# Altium schematic sheet SMUTop.SchDoc
size A; SheetNumber: 9; SheetTotal: 11
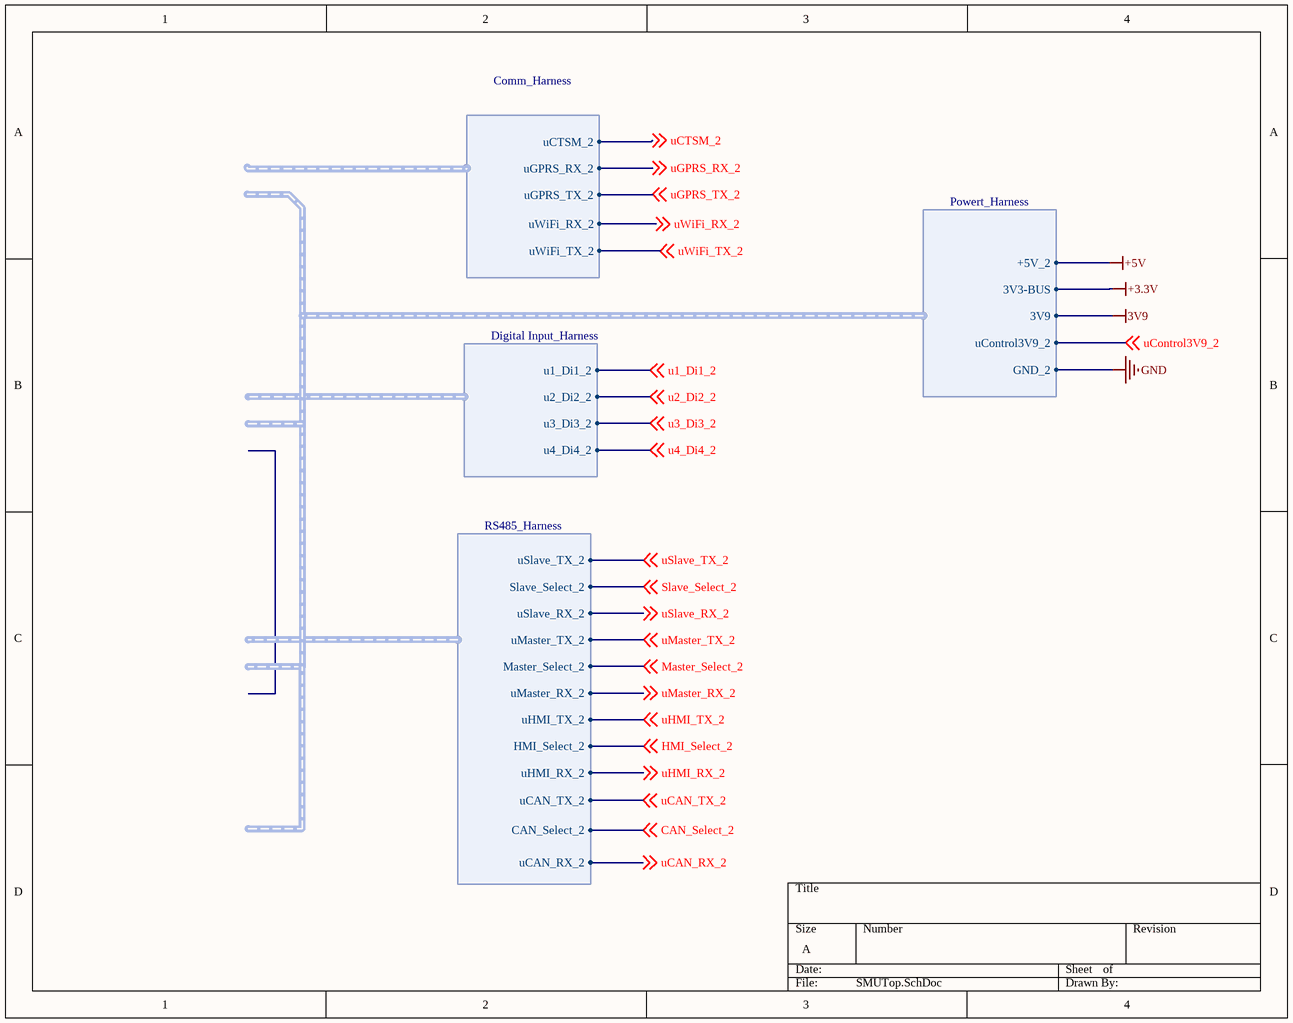
[diagram p0: SMUTop.SchDoc]

## Harnesses
Digital Input_Harness: u1_Di1_2, u2_Di2_2, u3_Di3_2, u4_Di4_2
Powert_Harness: +5V_2, 3V3-BUS, 3V9, uControl3V9_2, GND_2
RS485_Harness: uSlave_TX_2, Slave_Select_2, uSlave_RX_2, uMaster_TX_2, Master_Select_2, uMaster_RX_2, uHMI_TX_2, HMI_Select_2, uHMI_RX_2, uCAN_TX_2, CAN_Select_2, uCAN_RX_2
Comm_Harness: uCTSM_2, uGPRS_RX_2, uGPRS_TX_2, uWiFi_TX_2, uWiFi_RX_2

## Nets
3V9: harness Powert_Harness.3V9
+3.3V: harness Powert_Harness.3V3-BUS
+5V: harness Powert_Harness.+5V_2
GND: harness Powert_Harness.GND_2
CAN_Select_2: off-sheet CAN_Select_2, harness RS485_Harness.CAN_Select_2
HMI_Select_2: off-sheet HMI_Select_2, harness RS485_Harness.HMI_Select_2
Master_Select_2: off-sheet Master_Select_2, harness RS485_Harness.Master_Select_2
Slave_Select_2: off-sheet Slave_Select_2, harness RS485_Harness.Slave_Select_2
u1_Di1_2: off-sheet u1_Di1_2, harness Digital Input_Harness.u1_Di1_2
u2_Di2_2: off-sheet u2_Di2_2, harness Digital Input_Harness.u2_Di2_2
u3_Di3_2: off-sheet u3_Di3_2, harness Digital Input_Harness.u3_Di3_2
u4_Di4_2: off-sheet u4_Di4_2, harness Digital Input_Harness.u4_Di4_2
uCAN_RX_2: off-sheet uCAN_RX_2, harness RS485_Harness.uCAN_RX_2
uCAN_TX_2: off-sheet uCAN_TX_2, harness RS485_Harness.uCAN_TX_2
uControl3V9_2: off-sheet uControl3V9_2, harness Powert_Harness.uControl3V9_2
uCTSM_2: off-sheet uCTSM_2, harness Comm_Harness.uCTSM_2
uGPRS_RX_2: off-sheet uGPRS_RX_2, harness Comm_Harness.uGPRS_RX_2
uGPRS_TX_2: off-sheet uGPRS_TX_2, harness Comm_Harness.uGPRS_TX_2
uHMI_RX_2: off-sheet uHMI_RX_2, harness RS485_Harness.uHMI_RX_2
uHMI_TX_2: off-sheet uHMI_TX_2, harness RS485_Harness.uHMI_TX_2
uMaster_RX_2: off-sheet uMaster_RX_2, harness RS485_Harness.uMaster_RX_2
uMaster_TX_2: off-sheet uMaster_TX_2, harness RS485_Harness.uMaster_TX_2
uSlave_RX_2: off-sheet uSlave_RX_2, harness RS485_Harness.uSlave_RX_2
uSlave_TX_2: off-sheet uSlave_TX_2, harness RS485_Harness.uSlave_TX_2
uWiFi_RX_2: off-sheet uWiFi_RX_2, harness Comm_Harness.uWiFi_RX_2
uWiFi_TX_2: off-sheet uWiFi_TX_2, harness Comm_Harness.uWiFi_TX_2